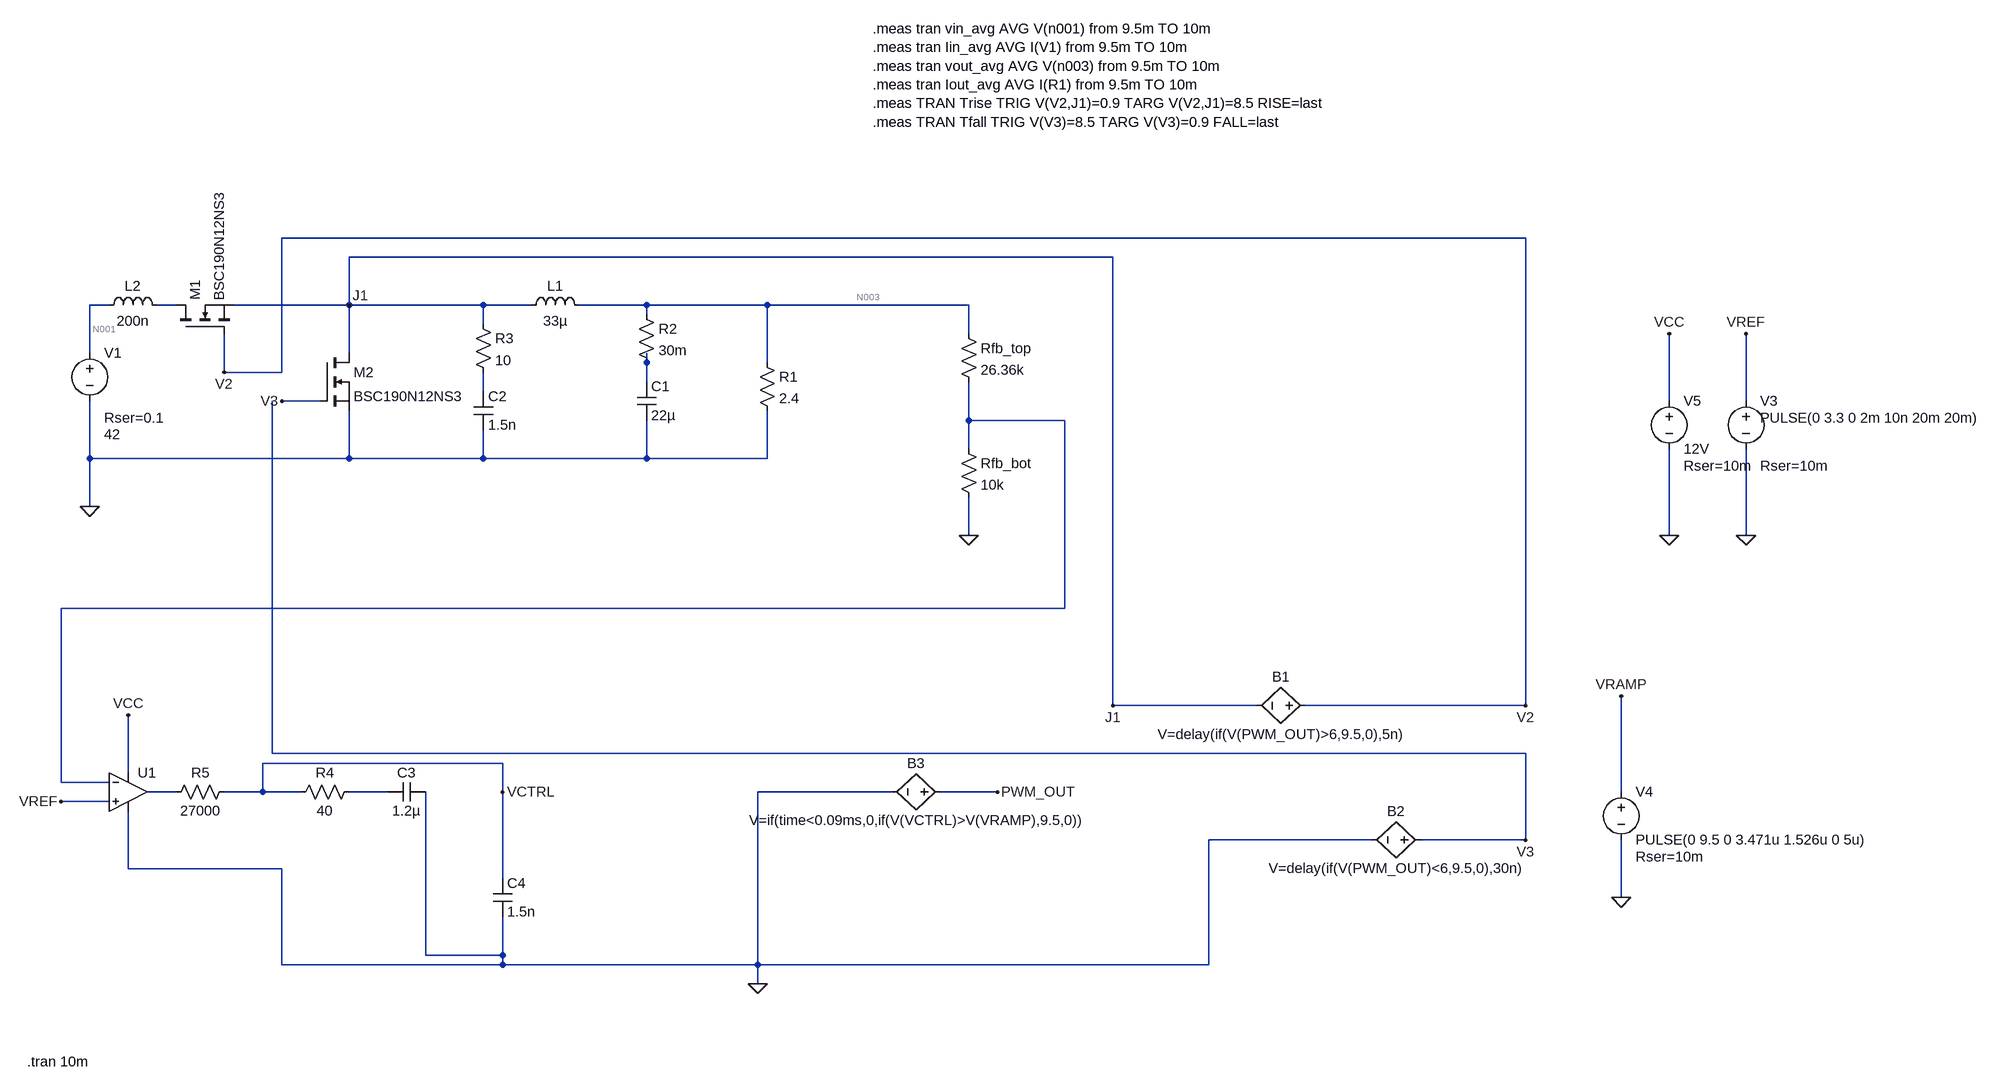
[diagram p0: schematic 60W Closed loop synchronous buck converter.asc]
60W Closed loop synchronous buck converter.asc, the LTspice schematic file:
Version 4.1
SHEET 1 3360 1636
WIRE 1968 -144 -160 -144
WIRE 1280 -112 -48 -112
WIRE -448 -32 -480 -32
WIRE -336 -32 -368 -32
WIRE -48 -32 -48 -112
WIRE -48 -32 -240 -32
WIRE 176 -32 -48 -32
WIRE 256 -32 176 -32
WIRE 448 -32 336 -32
WIRE 704 -32 448 -32
WIRE 1040 -32 704 -32
WIRE 448 -16 448 -32
WIRE 176 0 176 -32
WIRE 1040 16 1040 -32
WIRE -480 48 -480 -32
WIRE -48 48 -48 -32
WIRE 448 64 448 48
WIRE 704 64 704 -32
WIRE -256 80 -256 16
WIRE -160 80 -160 -144
WIRE -160 80 -256 80
WIRE 448 96 448 64
WIRE 176 112 176 80
WIRE -96 128 -160 128
WIRE 2784 128 2784 16
WIRE 2912 128 2912 16
WIRE 1040 160 1040 96
WIRE 1200 160 1040 160
WIRE 1040 208 1040 160
WIRE -480 224 -480 128
WIRE -48 224 -48 144
WIRE -48 224 -480 224
WIRE 176 224 176 176
WIRE 176 224 -48 224
WIRE 448 224 448 160
WIRE 448 224 176 224
WIRE 704 224 704 144
WIRE 704 224 448 224
WIRE -480 304 -480 224
WIRE 1040 352 1040 288
WIRE 2784 352 2784 208
WIRE 2912 352 2912 208
WIRE 1200 480 1200 160
WIRE 1200 480 -528 480
WIRE 1280 704 1280 -112
WIRE 1520 704 1280 704
WIRE 1968 704 1968 -144
WIRE 1968 704 1600 704
WIRE -176 784 -176 128
WIRE 1968 784 -176 784
WIRE 208 800 -192 800
WIRE -416 816 -416 720
WIRE -528 832 -528 480
WIRE -448 832 -528 832
WIRE -336 848 -384 848
WIRE -192 848 -192 800
WIRE -192 848 -256 848
WIRE -128 848 -192 848
WIRE 16 848 -48 848
WIRE 208 848 208 800
WIRE 912 848 688 848
WIRE 1088 848 992 848
WIRE 2704 848 2704 688
WIRE -448 864 -528 864
WIRE 1712 928 1440 928
WIRE 1968 928 1968 784
WIRE 1968 928 1792 928
WIRE -416 976 -416 880
WIRE -160 976 -416 976
WIRE 208 992 208 848
WIRE 2704 1024 2704 928
WIRE 80 1120 80 848
WIRE 208 1120 208 1056
WIRE 208 1120 80 1120
WIRE -160 1136 -160 976
WIRE 208 1136 208 1120
WIRE 208 1136 -160 1136
WIRE 688 1136 688 848
WIRE 688 1136 208 1136
WIRE 1440 1136 1440 928
WIRE 1440 1136 688 1136
WIRE 688 1168 688 1136
FLAG -256 80 V2
FLAG -480 304 0
FLAG -160 128 V3
FLAG -48 -32 J1
FLAG 1040 352 0
FLAG 2912 352 0
FLAG 2912 16 VREF
FLAG -528 864 VREF
FLAG -416 720 VCC
FLAG 1968 704 V2
FLAG 1968 928 V3
FLAG 2704 1024 0
FLAG 2704 688 VRAMP
FLAG 2784 16 VCC
FLAG 2784 352 0
FLAG 1088 848 PWM_OUT
FLAG 1280 704 J1
FLAG 208 848 VCTRL
FLAG 688 1168 0
SYMBOL ind 240 -16 R270
WINDOW 0 32 56 VTop 2
WINDOW 3 5 56 VBottom 2
SYMATTR InstName L1
SYMATTR Value 33µ
SYMATTR SpiceLine Rser=10m
SYMBOL cap 432 96 R0
SYMATTR InstName C1
SYMATTR Value 22µ
SYMBOL res 432 -32 R0
SYMATTR InstName R2
SYMATTR Value 30m
SYMBOL res 160 -16 R0
SYMATTR InstName R3
SYMATTR Value 10
SYMBOL cap 160 112 R0
SYMATTR InstName C2
SYMATTR Value 1.5n
SYMBOL voltage -480 32 R0
WINDOW 123 0 0 Left 0
WINDOW 39 24 124 Left 2
WINDOW 3 24 152 Left 2
SYMATTR SpiceLine Rser=0.1
SYMATTR Value 42
SYMATTR InstName V1
SYMBOL ind -464 -16 R270
WINDOW 0 32 56 VTop 2
WINDOW 3 5 56 VBottom 2
SYMATTR InstName L2
SYMATTR Value 200n
SYMATTR SpiceLine Rser=1m
SYMBOL nmos -96 48 R0
SYMATTR InstName M2
SYMATTR Value BSC190N12NS3
SYMBOL res 1024 0 R0
SYMATTR InstName Rfb_top
SYMATTR Value 26.36k
SYMBOL res 1024 192 R0
SYMATTR InstName Rfb_bot
SYMATTR Value 10k
SYMBOL voltage 2912 112 R0
WINDOW 123 0 0 Left 0
WINDOW 39 24 124 Left 2
WINDOW 3 24 44 Left 2
SYMATTR SpiceLine Rser=10m
SYMATTR Value PULSE(0 3.3 0 2m 10n 20m 20m)
SYMATTR InstName V3
SYMBOL res -32 832 R90
WINDOW 0 0 56 VBottom 2
WINDOW 3 32 56 VTop 2
SYMATTR InstName R4
SYMATTR Value 40
SYMBOL cap 80 832 R90
WINDOW 0 0 32 VBottom 2
WINDOW 3 32 32 VTop 2
SYMATTR InstName C3
SYMATTR Value 1.2µ
SYMBOL voltage 2704 832 R0
WINDOW 123 0 0 Left 0
WINDOW 39 24 124 Left 2
SYMATTR SpiceLine Rser=10m
SYMATTR InstName V4
SYMATTR Value PULSE(0 9.5 0 3.471u 1.526u 0 5u)
SYMBOL OpAmps\\UniversalOpAmp2 -416 848 R0
SYMATTR InstName U1
SYMBOL bv 1808 928 R90
WINDOW 0 -32 56 VBottom 2
WINDOW 3 32 56 VTop 2
SYMATTR InstName B2
SYMATTR Value V=delay(if(V(PWM_OUT)<6,9.5,0),30n)
SYMBOL bv 1616 704 R90
WINDOW 0 -32 56 VBottom 2
WINDOW 3 32 56 VTop 2
SYMATTR InstName B1
SYMATTR Value V=delay(if(V(PWM_OUT)>6,9.5,0),5n)
SYMBOL nmos -336 16 R270
SYMATTR InstName M1
SYMATTR Value BSC190N12NS3
SYMBOL voltage 2784 112 R0
WINDOW 123 0 0 Left 0
WINDOW 39 24 124 Left 2
SYMATTR SpiceLine Rser=10m
SYMATTR InstName V5
SYMATTR Value 12V
SYMBOL bv 1008 848 R90
WINDOW 0 -32 56 VBottom 2
WINDOW 3 32 56 VTop 2
SYMATTR InstName B3
SYMATTR Value V=if(time<0.09ms,0,if(V(VCTRL)>V(VRAMP),9.5,0))
SYMBOL res -240 832 R90
WINDOW 0 0 56 VBottom 2
WINDOW 3 32 56 VTop 2
SYMATTR InstName R5
SYMATTR Value 27000
SYMBOL cap 192 992 R0
SYMATTR InstName C4
SYMATTR Value 1.5n
SYMBOL res 688 48 R0
SYMATTR InstName R1
SYMATTR Value 2.4
TEXT 880 -1120 Left 2 !.meas tran vin_avg AVG V(n001) from 9.5m TO 10m\n.meas tran Iin_avg AVG I(V1) from 9.5m TO 10m\n.meas tran vout_avg AVG V(n003) from 9.5m TO 10m\n.meas tran Iout_avg AVG I(R1) from 9.5m TO 10m\n.meas TRAN Trise TRIG V(V2,J1)=0.9 TARG V(V2,J1)=8.5 RISE=last\n.meas TRAN Tfall TRIG V(V3)=8.5 TARG V(V3)=0.9 FALL=last
TEXT -584 1416 Left 2 !.tran 10m

The netlist it stands for:
* 60W Closed loop synchronous buck converter.asc
L1 J1 N003 33µ Rser=10m
C1 N004 0 22µ
R2 N003 N004 30m
R3 J1 N005 10
C2 N005 0 1.5n
V1 N001 0 42 Rser=0.1
L2 N001 N002 200n Rser=1m
M2 J1 V3 0 0 BSC190N12NS3
Rfb_top N003 N006 26.36k
Rfb_bot N006 0 10k
V3 VREF 0 PULSE(0 3.3 0 2m 10n 20m 20m) Rser=10m
R4 N008 VCTRL 40
C3 0 N008 1.2µ
V4 VRAMP 0 PULSE(0 9.5 0 3.471u 1.526u 0 5u) Rser=10m
X§U1 VREF N006 VCC 0 N007 level2 Avol=1Meg GBW=10Meg Slew=10Meg Ilimit=25m Rail=0 Vos=0 En=0 Enk=0 In=0 Ink=0 Rin=500Meg  ; pins In+ In- V+ V- OUT
B2 V3 0 V=delay(if(V(PWM_OUT)<6,9.5,0),30n)
B1 V2 J1 V=delay(if(V(PWM_OUT)>6,9.5,0),5n)
M1 N002 V2 J1 J1 BSC190N12NS3
V5 VCC 0 12V Rser=10m
B3 PWM_OUT 0 V=if(time<0.09ms,0,if(V(VCTRL)>V(VRAMP),9.5,0))
R5 VCTRL N007 27000
C4 VCTRL 0 1.5n
R1 N003 0 2.4
.model NMOS NMOS
.model PMOS PMOS
.lib standard.mos
.meas tran vin_avg AVG V(n001) from 9.5m TO 10m
.meas tran Iin_avg AVG I(V1) from 9.5m TO 10m
.meas tran vout_avg AVG V(n003) from 9.5m TO 10m
.meas tran Iout_avg AVG I(R1) from 9.5m TO 10m
.meas TRAN Trise TRIG V(V2,J1)=0.9 TARG V(V2,J1)=8.5 RISE=last
.meas TRAN Tfall TRIG V(V3)=8.5 TARG V(V3)=0.9 FALL=last
.tran 10m
.lib UniversalOpAmp2.lib
.backanno
.end